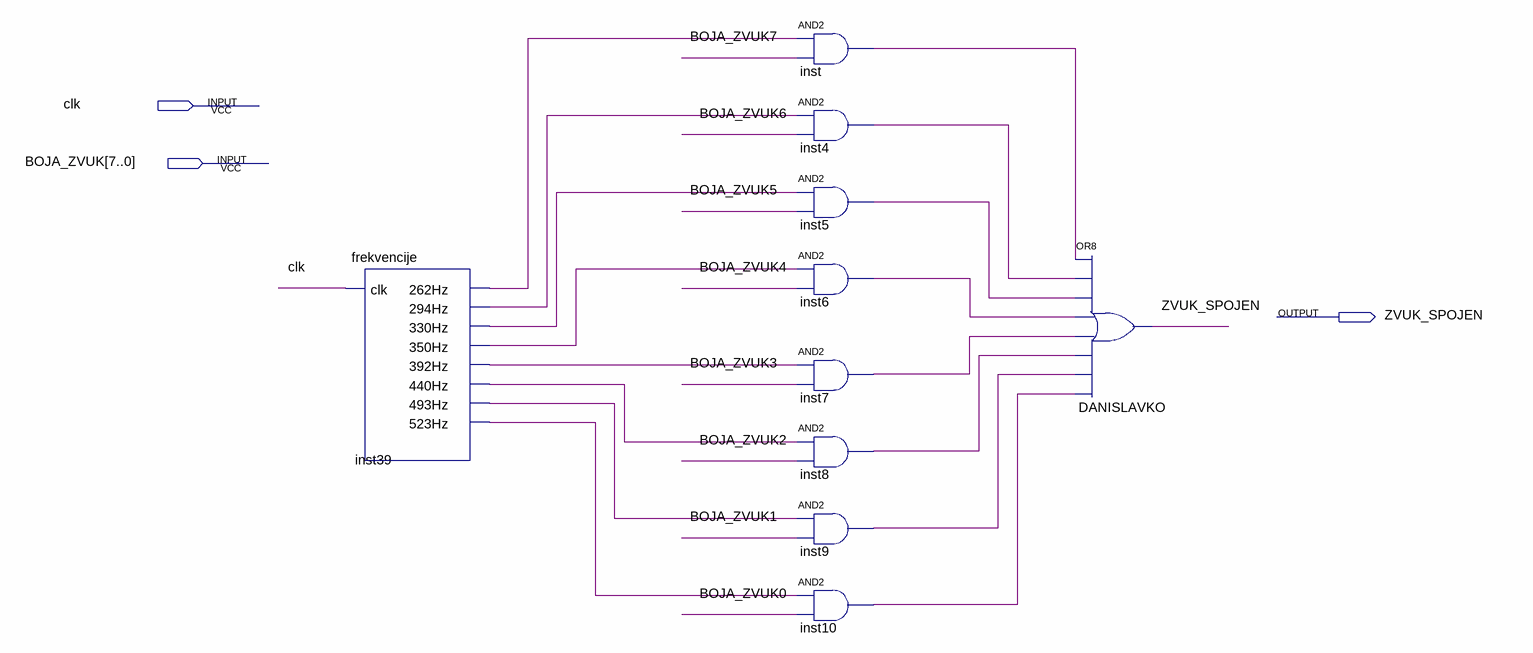
[diagram p0: schematic sheet]
// Quartus schematic spajalica.bdf as structural Verilog: 10 symbols, 3 pins
module spajalica (
  input  clk,
  input  [7:0] BOJA_ZVUK,
  output ZVUK_SPOJEN
);

  wire inst4_out, inst5_out, inst6_out, inst7_out, inst8_out, inst9_out, inst10_out, inst39_262hz,
       inst39_294hz, inst39_330hz, inst39_350hz, inst39_392hz, inst39_440hz, inst39_493hz, inst39_523hz,
       inst_out;

  frekvencije inst39 (
    .clk(clk), .\262Hz (inst39_262hz), .\294Hz (inst39_294hz), .\330Hz (inst39_330hz),
    .\350Hz (inst39_350hz), .\392Hz (inst39_392hz), .\440Hz (inst39_440hz), .\493Hz (inst39_493hz),
    .\523Hz (inst39_523hz));
  and inst (inst_out, inst39_262hz, BOJA_ZVUK[7]);
  and inst4 (inst4_out, inst39_294hz, BOJA_ZVUK[6]);
  and inst5 (inst5_out, inst39_330hz, BOJA_ZVUK[5]);
  and inst6 (inst6_out, inst39_350hz, BOJA_ZVUK[4]);
  and inst7 (inst7_out, inst39_392hz, BOJA_ZVUK[3]);
  and inst8 (inst8_out, inst39_440hz, BOJA_ZVUK[2]);
  and inst9 (inst9_out, inst39_493hz, BOJA_ZVUK[1]);
  and inst10 (inst10_out, inst39_523hz, BOJA_ZVUK[0]);
  or DANISLAVKO (ZVUK_SPOJEN, inst_out, inst4_out, inst5_out, inst6_out, inst7_out, inst8_out, inst9_out, inst10_out);
endmodule
